# Altium schematic sheet Sheet1.SchDoc
size A4
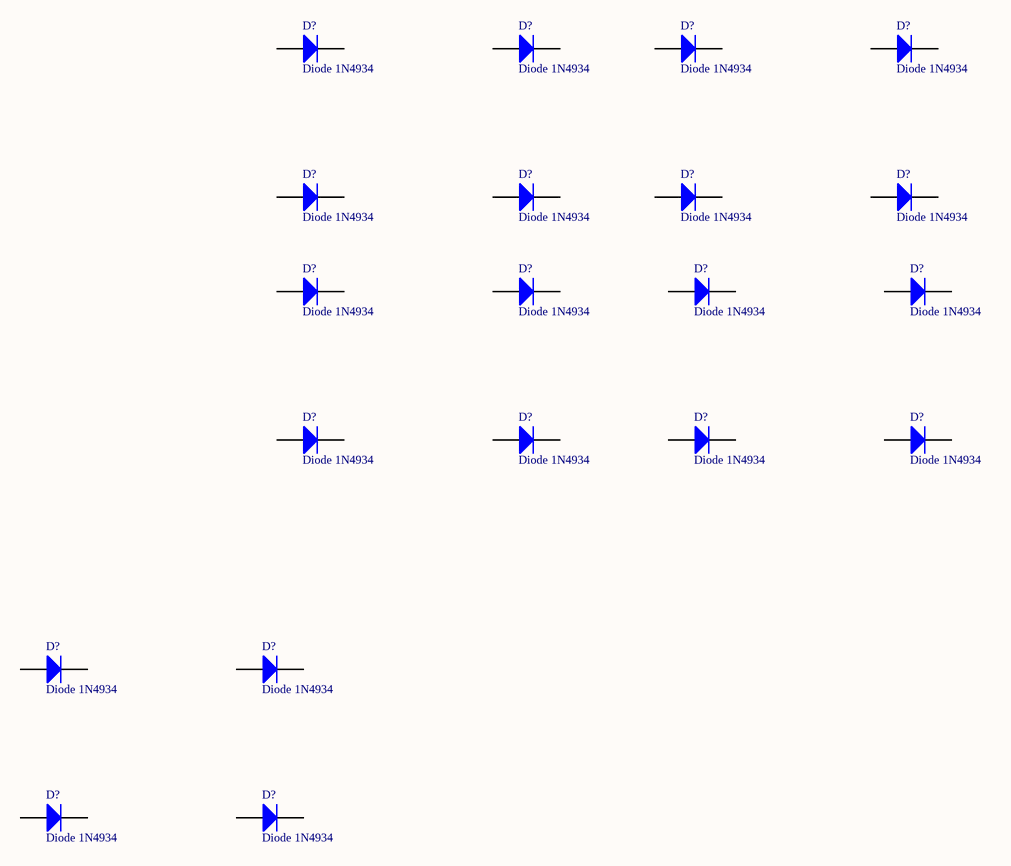
[diagram p0: Sheet1.SchDoc]

## Parts
(Parts that share a designator on the sheet are numbered #1, #2 ... from top to bottom, then left to right.)
D?#1  Diode 1N4934  [DO-41]
D?#2  Diode 1N4934  [DO-41]
D?#3  Diode 1N4934  [DO-41]
D?#4  Diode 1N4934  [DO-41]
D?#5  Diode 1N4934  [DO-41]
D?#6  Diode 1N4934  [DO-41]
D?#7  Diode 1N4934  [DO-41]
D?#8  Diode 1N4934  [DO-41]
D?#9  Diode 1N4934  [DO-41]
D?#10  Diode 1N4934  [DO-41]
D?#11  Diode 1N4934  [DO-41]
D?#12  Diode 1N4934  [DO-41]
D?#13  Diode 1N4934  [DO-41]
D?#14  Diode 1N4934  [DO-41]
D?#15  Diode 1N4934  [DO-41]
D?#16  Diode 1N4934  [DO-41]
D?#17  Diode 1N4934  [DO-41]
D?#18  Diode 1N4934  [DO-41]
D?#19  Diode 1N4934  [DO-41]
D?#20  Diode 1N4934  [DO-41]

## Nets

Not connected (* = marked no-connect by the designer): D?#1 1(A) 2(K); D?#2 1(A) 2(K); D?#3 1(A) 2(K); D?#4 1(A) 2(K); D?#5 1(A) 2(K); D?#6 1(A) 2(K); D?#7 1(A) 2(K); D?#8 1(A) 2(K); D?#9 1(A) 2(K); D?#10 1(A) 2(K); D?#11 1(A) 2(K); D?#12 1(A) 2(K); D?#13 1(A) 2(K); D?#14 1(A) 2(K); D?#15 1(A) 2(K); D?#16 1(A) 2(K); D?#17 1(A) 2(K); D?#18 1(A) 2(K); D?#19 1(A) 2(K); D?#20 1(A) 2(K)

## Library data of the parts
D?#1-D?#20 = Diode 1N4934: 1 Amp Fast Recovery Rectifier; Published: 8-Jun-2000; LatestRevisionDate: 17-Jul-2002; LatestRevisionNote: Re-released for DXP Platform.; DatasheetVersion: 1999; PackageVersion: Aug-1999; PackageReference: DO-41; Publisher: Altium Limited; PackageDescription: Diode, Axial; Body 5.2 x 2.7 mm (LxDia. max), Lead Dia. 0.86 mm (max); Code_JEDEC: DO-204-AL; ComponentLink1Description: Manufacturer Link; ComponentLink1URL: http://www.fairchildsemi.com/; ComponentLink2Description: Datasheet; ComponentLink2URL: http://www.fairchildsemi.com/ds/1N%2F1N4934.pdf